# Altium schematic sheet 锂电池电量显示.SchDoc
size A4; SheetNumber: 5; SheetTotal: 7
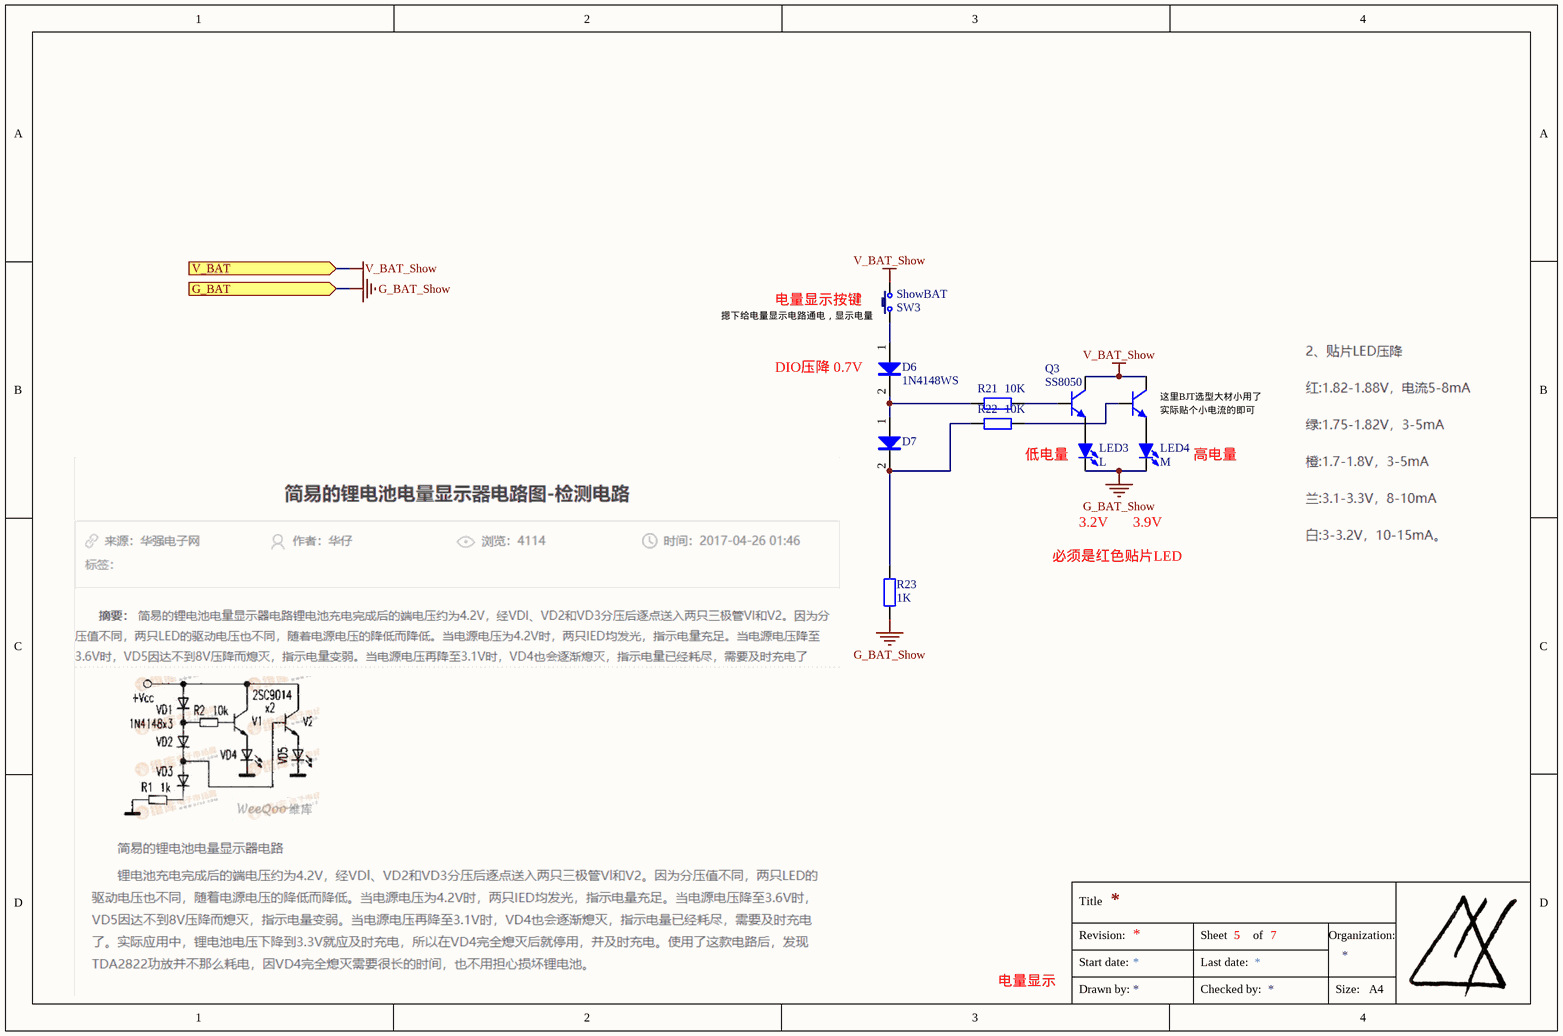
[diagram p0: 锂电池电量显示.SchDoc]

## Parts
D6  1N4148WS  [SOD-323]
D7  1N4148WS  [SOD-323]  (value not drawn)
LED3  L  [LED 0805R]
LED4  M  [LED 0805R]
Q3  SS8050  [SOT23-3N]
Q4  SS8050  [SOT23-3N]  (value not drawn)
R21  10K  [R 0402_L]
R22  10K  [R 0402_L]
R23  1K  [R 0402_L]
SW3  ShowBAT  [TSW DIP-3*6*5_V]

## Ports
G_BAT (in), V_BAT (in)

## Nets
G_BAT_Show: LED3.2(K) LED4.2(K) R23.2 ; port G_BAT
V_BAT_Show: Q3.3(C) Q4.3(C) SW3.2 ; port V_BAT
NetD6_1: D6.1(A) SW3.1
NetD6_2: D6.2(K) D7.1(A) R21.1
NetD7_2: D7.2(K) R22.1 R23.1
NetLED3_1: LED3.1(A) Q3.2(E)
NetLED4_1: LED4.1(A) Q4.2(E)
NetQ3_1: Q3.1(B) R21.2
NetQ4_1: Q4.1(B) R22.2

## Notes on the sheet
- 电量显示按键
- 摁下给电量显示电路通电，显示电量
- DIO压降 0.7V
- (near Q4) 这里BJT选型大材小用了
- (near Q4) 实际贴个小电流的即可
- 低电量
- 高电量
- 必须是红色贴片LED
- 3.2V
- 3.9V
- 电量显示
- Title
- Start date:
- Revision:
- Sheet
- Last date:
- of
- Organization:
- Drawn by:
- Checked by:
- Size:
- A4

## Library data of the parts
D6 D7 = 1N4148: 高速开关二极管; 版权归属: 源创客; BOM名称: 高速开关二极管; 学习资源: www.ooocke.com
LED3 LED4 = LED-SMD: 贴片LED 红色; 版权归属: 源创客; BOM名称: 贴片LED 红色; 学习资源: www.ooocke.com
Q3 Q4 = 8050-SMD: 高频放大-NPN型; 版权归属: 源创客; 属性: 40V 1.5A 1W 100MHZ; BOM名称: 高频放大-NPN型; 学习资源: www.ooocke.com
R21-R23 = R: 贴片电阻 E-96 1%; BOM名称: E-96 1%
SW3 = TSW 3x6: 3x6轻触开关; 版权归属: 源创客; BOM名称: 3x6轻触开关; 学习资源: www.ooocke.com